# Altium schematic sheet 14-Cypress.SchDoc
size 431 x 279 mm; Organization: ORGANIZATION; Address1: ADDRESS 1; Address2: ADDRESS 2; Address3: ADDRESS 3; Address4: ADDRESS 4; DocumentNumber: 10; Revision: -; SheetNumber: 14; SheetTotal: 14; ENG_APP_DATE: --/--/--; DSN_APP_DATE: --/--/--; CHK_APP_DATE: --/--/--
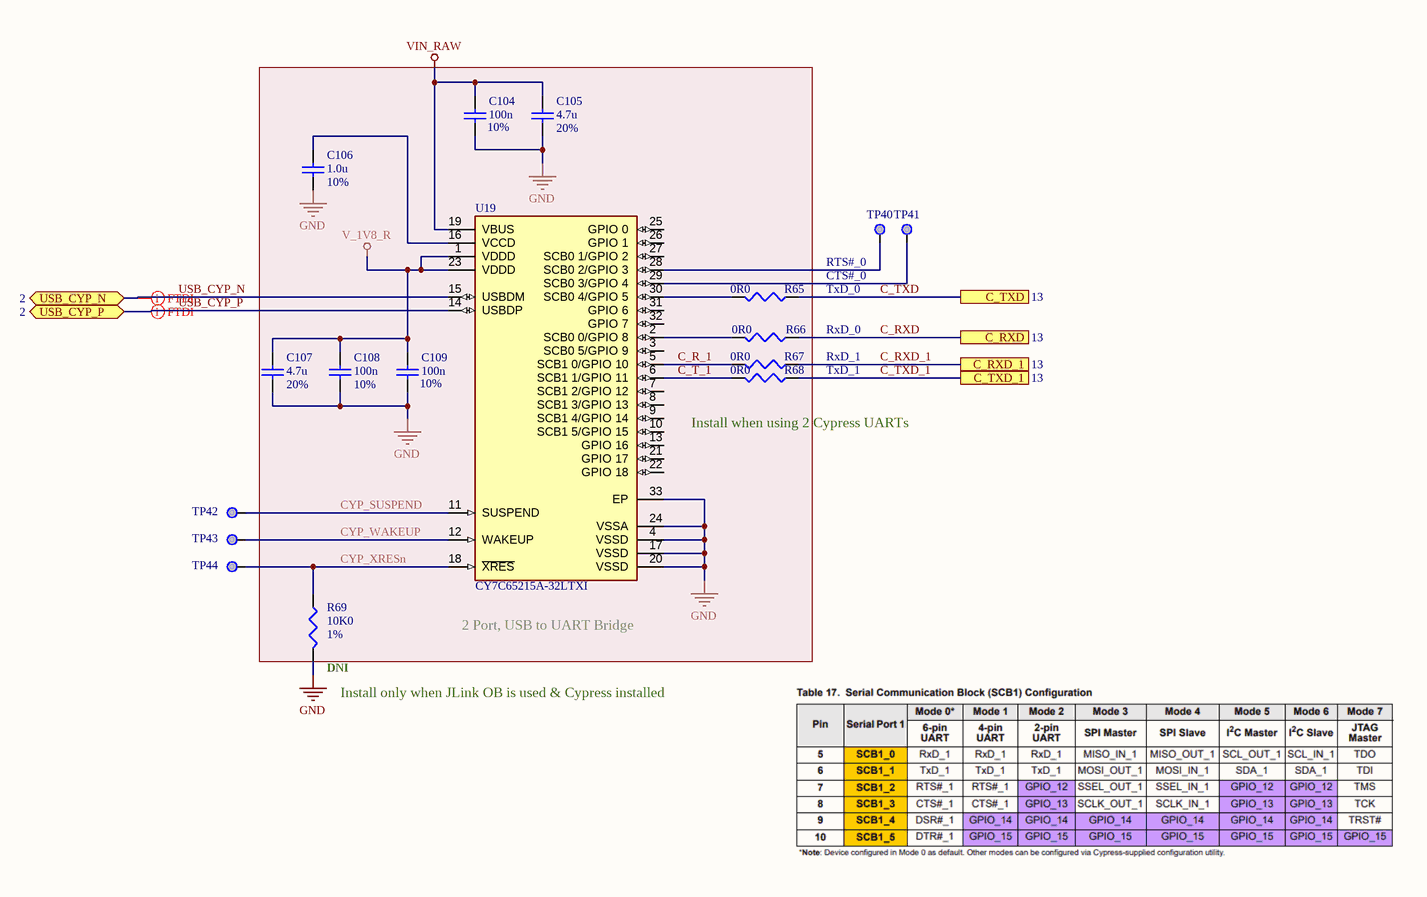
[diagram p0: 14-Cypress.SchDoc]

## Parts
C104  value 100n  Tolerance: 10%  [CAPC0402-01]  (hidden comment: Cap)
C105  value 4.7u  Tolerance: 20%  [CAPC0402-01]  (hidden comment: Cap)
C106  value 1.0u  Tolerance: 10%  [CAPC0402-01]  (hidden comment: Cap)
C107  value 4.7u  Tolerance: 20%  [CAPC0402-01]  (hidden comment: Cap)
C108  value 100n  Tolerance: 10%  [CAPC0402-01]  (hidden comment: Cap)
C109  value 100n  Tolerance: 10%  [CAPC0402-01]  (hidden comment: Cap)
R65  value 0R0  [RESC0402-01]  (hidden comment: Res3)
R66  value 0R0  [RESC0402-01]  (hidden comment: Res3)
R67  value 0R0  [RESC0402-01]  (hidden comment: Res3)
R68  value 0R0  [RESC0402-01]  (hidden comment: Res3)
R69  value 10K0  Tolerance: 1%  [RESC0402-01]  (hidden comment: Res3)
TP40  TP_SMPAD  [TP_50_RND]  (value not drawn)  (no BOM)
TP41  TP_SMPAD  [TP_50_RND]  (value not drawn)  (no BOM)
TP42  TP_SMPAD  [TP_50_RND]  (value not drawn)  (no BOM)
TP43  TP_SMPAD  [TP_50_RND]  (value not drawn)  (no BOM)
TP44  TP_SMPAD  [TP_50_RND]  (value not drawn)  (no BOM)
U19  CY7C65215A-32LTXI  [QFN32_5x5x1-0p5_INF-M_no3D]

## Ports
C_RXD (see 13), C_RXD_1 (see 13), C_TXD (see 13), C_TXD_1 (see 13), USB_CYP_N (bidir, see 2), USB_CYP_P (bidir, see 2)

## Nets
GND: C104.1 C105.1 C106.1 C107.1 C108.1 C109.1 R69.2 U19.4(VSSD) U19.17(VSSD) U19.20(VSSD) U19.24(VSSA) U19.33(EP)
V_1V8_R: C107.2 C108.2 C109.2 U19.1(VDDD) U19.23(VDDD)
VIN_RAW: C104.2 C105.2 U19.19(VBUS)
C_R_1: R67.2 U19.5(SCB1_0/GPIO_10)
C_RXD: R66.1 ; port C_RXD
C_RXD_1: R67.1 ; port C_RXD_1
C_T_1: R68.2 U19.6(SCB1_1/GPIO_11)
C_TXD: R65.1 ; port C_TXD
C_TXD_1: R68.1 ; port C_TXD_1
CYP_SUSPEND: TP42.1 U19.11(SUSPEND)
CYP_WAKEUP: TP43.1 U19.12(WAKEUP)
CYP_XRESn: R69.1 TP44.1 U19.18(~{XRES})
USB_CYP_N: U19.15(USBDM) ; port USB_CYP_N
USB_CYP_P: U19.14(USBDP) ; port USB_CYP_P
NetC106_2: C106.2 U19.16(VCCD)
NetR65_2: R65.2 U19.30(SCB0_4/GPIO_5)
NetR66_2: R66.2 U19.2(SCB0_0/GPIO_8)
NetTP40_1: TP40.1 U19.28(SCB0_2/GPIO_3)
NetTP41_1: TP41.1 U19.29(SCB0_3/GPIO_4)

Not connected (* = marked no-connect by the designer): U19 3(SCB0_5/GPIO_9) 7(SCB1_2/GPIO_12) 8(SCB1_3/GPIO_13) 9(SCB1_4/GPIO_14) 10(SCB1_5/GPIO_15) 13(GPIO_16) 21(GPIO_17) 22(GPIO_18) 25(GPIO_0) 26(GPIO_1) 27(SCB0_1/GPIO_2) 31(GPIO_6) 32(GPIO_7)

## Layout directives
differential pair; differential pair class USB_CYP_: USB_CYP_N, USB_CYP_P

## Notes on the sheet
- RTS#_0
- CTS#_0
- TxD_0
- RxD_0
- RxD_1
- TxD_1
- Install when using 2 Cypress UARTs
- (near U19) 2 Port, USB to UART Bridge
- (near R69) DNI
- (near R69) Install only when JLink OB is used & Cypress installed
- DWG. NO.
- REV
- SHT
- REVISION
- DESCRIPTION
- DATE
- APPROVED
- ENG:
- APPROVALS
- PROJECT
- Suite 300
- Alif Semiconductor
- 7901 Stoneridge Drive
- DSN:
- CHK:
- REFERENCE DOCUMENTS
- TITLE
- Pleasanton, CA 94588  USA
- BOM:
- FAB DWG:
- PCB DWG:
- ASSY DWG:
- SCALE:
- SIZE
- B
- CAGE CODE
- FILE NAME
- DWG NO.
- SHEET
- OF
- none

## Library data of the parts
C104 C108 C109 = Cap: DNI,Cap,100nF,10%,50V,X7R,0402; Manufacturer 1: TDK; Manufacturer Part Number 1: C1005X7R1H104K050BE; PCB_Footprint: CC0402; Published: 8-Jun-2000; LatestRevisionDate: 17-Jul-2002; LatestRevisionNote: Re-released for DXP Platform.; PackageReference: RAD-0.3; Publisher: Altium Limited; PackageDescription: Radial Cap, Thru-Hole; 2 Leads; 0.3 in Pin Spacing; Max_Height: 0.60mm; Manufacturer 2: Samsung; Manufacturer Part Number 2: CL05B104KB54PNC; Manufacturer 3: Walsin; Manufacturer Part Number 3: 0402B104K500CT; Type: X7R; Voltage: 50V
C105 C107 = Cap_225M25VX5R0402_1: DNI,Cap,4.7uF,20%,10V,X5R,0402; Manufacturer 1: TDK; Manufacturer Part Number 1: C1005X5R1A475K050BC; PCB_Footprint: CC0402; Published: 8-Jun-2000; LatestRevisionDate: 17-Jul-2002; LatestRevisionNote: Re-released for DXP Platform.; PackageReference: RAD-0.3; Publisher: Altium Limited; PackageDescription: Radial Cap, Thru-Hole; 2 Leads; 0.3 in Pin Spacing; Max_Height: 0.60mm; Type: X5R; Voltage: 10V; Manufacturer 2: Kyocera; Manufacturer Part Number 2: 0402YD475MAT2A; Manufacturer 3: Samsung; Manufacturer Part Number 3: CL05A475MP5NRNC
C106 = Cap: DNI,Cap,1.0uF,20%,25V,X5R,0402; Manufacturer 1: TDK; Manufacturer Part Number 1: CGB2A1X5R1E105K033BC; PCB_Footprint: CC0402; Published: 8-Jun-2000; LatestRevisionDate: 17-Jul-2002; LatestRevisionNote: Re-released for DXP Platform.; PackageReference: RAD-0.3; Publisher: Altium Limited; PackageDescription: Radial Cap, Thru-Hole; 2 Leads; 0.3 in Pin Spacing; Max_Height: 0.60mm; Manufacturer 2: Yageo; Manufacturer Part Number 2: CC0402KRX5R8BB105; Manufacturer 3: Murata; Manufacturer Part Number 3: GRM155R61E105KA12D; Type: X5R; Voltage: 25V
R65-R68 = Res3: DNI,Res,0R ohm,Jumper,0402; Manufacturer 1: Stackpol; Manufacturer Part Number 1: RMCF0402ZT0R00; Wattage: 63mW; Tolerance: JMPR; Published: 8-Jun-2000; LatestRevisionDate: 29-May-2009; LatestRevisionNote: IPC-7351 Footprint Added.; PackageReference: RESC0402-01; Publisher: Altium Limited; PackageDescription: Chip Resistor; Voltage: *; Type: Thick Film; Manufacturer 2: Yageo; Manufacturer Part Number 2: RC0402FR-070RL; Manufacturer 3: Panasonic; Manufacturer Part Number 3: ERJ-XGN0R00Y; PCB_Footprint: RESC0402-01
R69 = Res3: DNI,Res,10K0,1%,100ppm,0402; Manufacturer 1: Stackpol; Manufacturer Part Number 1: RMCF0402FT10K0; Wattage: 63mW; Published: 8-Jun-2000; LatestRevisionDate: 29-May-2009; LatestRevisionNote: IPC-7351 Footprint Added.; PackageReference: RESC0402-01; Publisher: Altium Limited; PackageDescription: Chip Resistor; Voltage: *; Type: Thick Film; Manufacturer 2: Yageo; Manufacturer Part Number 2: RC0402FR-0710KL; Manufacturer 3: Bourns; Manufacturer Part Number 3: CR0402-FX-1002GLF; PCB_Footprint: RESC0402-01
TP40-TP44 = TP_SMPAD: DNI,Test Point, SMT Pad,--not a BOM item--; PCB_Footprint: TP_PAD1
U19 = IC_Dual_USB_UART_Bridge: DNI,IC,Dual USB to Serial Bridge,32QFN; Manufacturer 1: Cypress; Import Ts: 1521861523; Ciiva Ids: 12522558; Interface: I2C,SPI,UART,USB; Min Supply Voltage: 1.71V; Standoff Height: 0mm; Max Supply Voltage: 5.5V; Nominal Supply Current: 13mA; Digikey Description: IC USB TO SERIAL BRIDGE 32QFN; Temperature Range High: +85°C; Category: IC; ComponentLink2Description: Datasheet; Release Date: 1401362620; Manufacturer Part Number 1: CY7C65215A-32LTXI; Octopart: https://octopart.com/cy7c65215-32ltxi-cypress+semiconductor-30243522; Lead Free: Yes; Device Class L2: Interface ICs; RoHS: TRUE; Height: 1mm; Device Class L3: Controllers; Temperature Range Low: -40°C; Ambient Temperature Range High: +85°C; Ipc Land Pattern Name: QFN50P500X500X90-32; Ambient Temperature Range Low: -40°C; Device Class L1: Integrated Circuits (ICs); Package: 001-30999; Mouser Description: USB Interface IC USB-Serial Dual CH Bridge; Temperature: -40°C to +85°C; Automotive: No; ComponentLink2URL: https://www.cypress.com/file/129956/download